# EAGLE design D1 - No LCD (EAGLE 9.5.2)
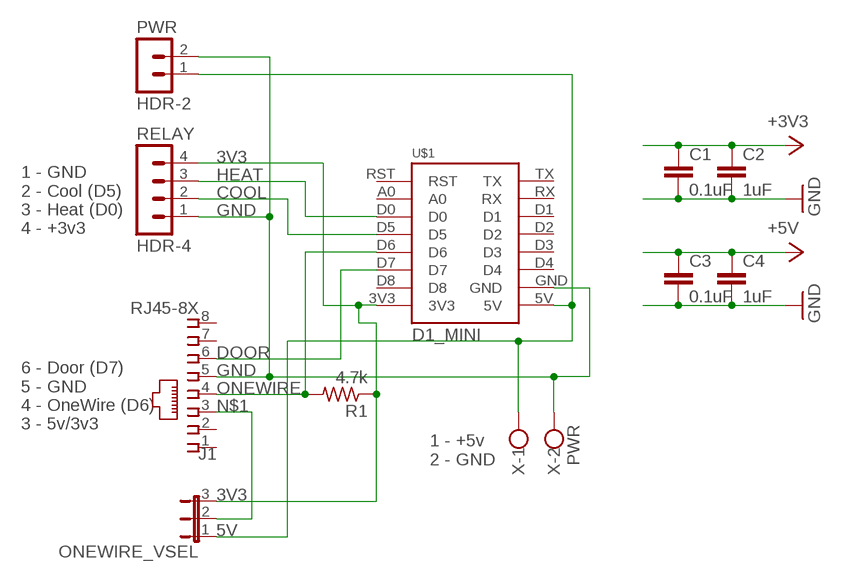
[diagram p0: schematic, sheet 1]

## Parts
C1  0.1uF  C-EU050-030X075  [C050-030X075]
C2  1uF  C-EU050-030X075  [C050-030X075]
C3  0.1uF  C-EU050-030X075  [C050-030X075]
C4  1uF  C-EU050-030X075  [C050-030X075]
J1  RJ45-8X  [RJ45-NS-XDIM]
ONEWIRE_VSEL  JP2ENOLABEL  [JP2-NOLABEL]
PWR  HDR-2  [HDR-2_VERT]
R1  4.7k  R-US_0309/12  [0309/12]
RELAY  HDR-4  [HDR-4_VERT]
U$1  D1_MINI  WEMOSCLEAN  [WEMOS-CLEAN]
X  PWR  W237-102  [W237-102]

## Nets
3V3 [3v]: C1.1 C2.1 ONEWIRE_VSEL.3 R1.1 RELAY.4 U$1.3V3 ; supply symbol labelled +3V3
5V [5v]: C3.1 C4.1 ONEWIRE_VSEL.1 PWR.1 U$1.5V X.1 ; supply symbol labelled +5V
COOL: RELAY.2 U$1.D5
DOOR: J1.6 U$1.D7
GND [Gnd]: C1.2 C2.2 C3.2 C4.2 J1.5 PWR.2 RELAY.1 U$1.GND X.2
HEAT: RELAY.3 U$1.D0
N$1: J1.3 ONEWIRE_VSEL.2
ONEWIRE: J1.4 R1.2 U$1.D6
Unconnected: J1.1 J1.2 J1.7 J1.8 U$1.A0 U$1.D1 U$1.D2 U$1.D3 U$1.D4 U$1.D8 U$1.RST U$1.RX U$1.TX

## Notes on the sheet
- 1 - GND
  2 - Cool (D5)
  3 - Heat (D0)
  4 - +3v3
- 6 - Door (D7)
  5 - GND
  4 - OneWire (D6) 
  3 - 5v/3v3
- 1 - +5v
  2 - GND

## Library data of the parts
C1-C4 = rcl:C-EU: CAPACITOR, European symbol; SPICEPREFIX: C
J1 = Donnie:RJ45: CORCOM Modular RJ Jacks No Shield Source: www.tycoelectronics.com .. ENG_DS_1654001_1099_RJ_L_0507.pdf; MPN: RJ45-8X; OC_FARNELL: unknown; OC_NEWARK: 16R6101
ONEWIRE_VSEL = Donnie:JP2E: JUMPER
PWR = Donnie:HDR-2
R1 = rcl:R-US_: RESISTOR, American symbol; SPICEPREFIX: R
RELAY = Donnie:HDR-4: PIN HEADER
U$1 = 1455413453956-wemos:WEMOS: LoLin D1 Mini controller socket
X = con-wago-500:W237-102: WAGO SCREW CLAMP; MPN: 237-102; OC_FARNELL: unknown; OC_NEWARK: 70K9898

## Net classes
0 default: width 0.305 mm, clearance 0.305 mm
1 5v: width 0.406 mm, clearance 0.406 mm
2 3v: width 0.406 mm, clearance 0.406 mm
3 Gnd: width 0.406 mm, clearance 0.406 mm

## Board
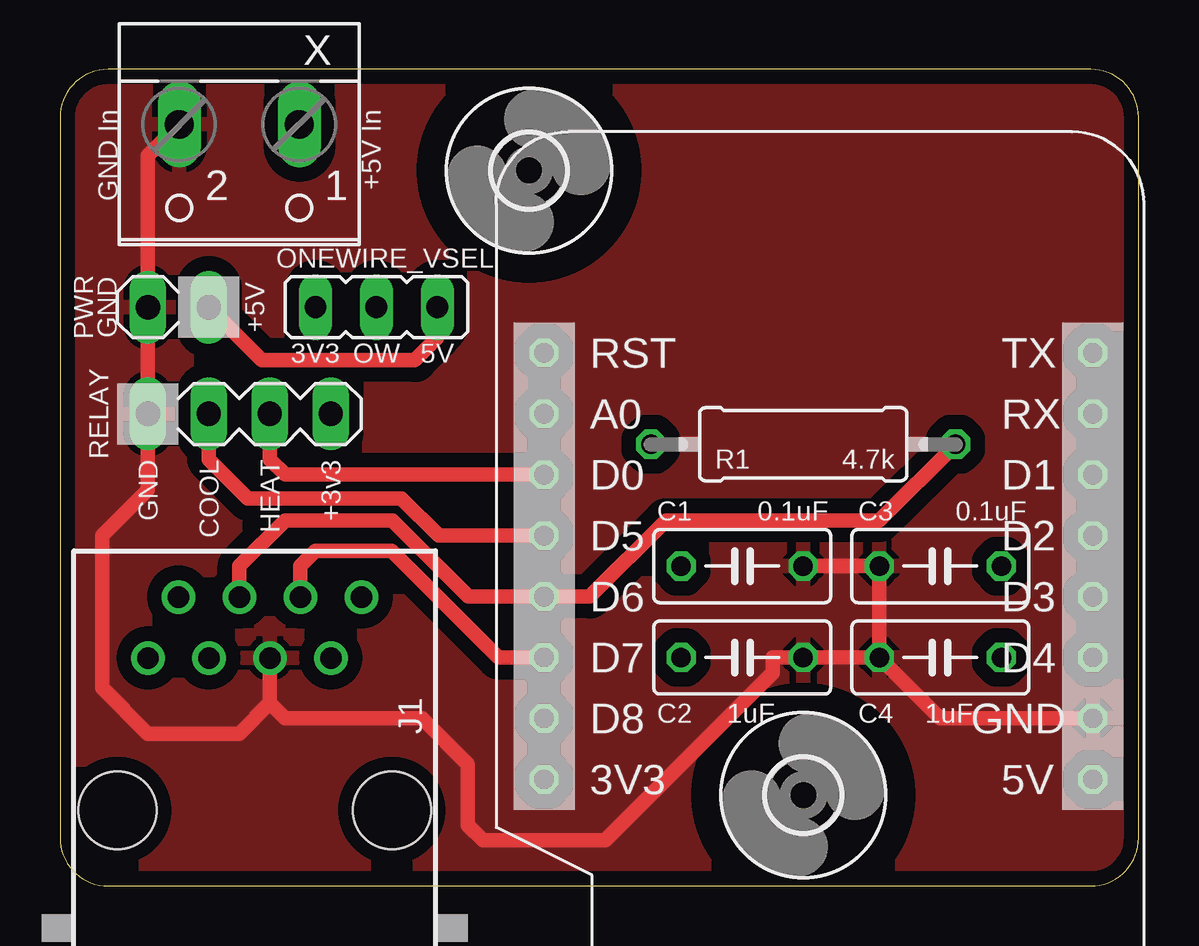
[diagram p1: board, top side]
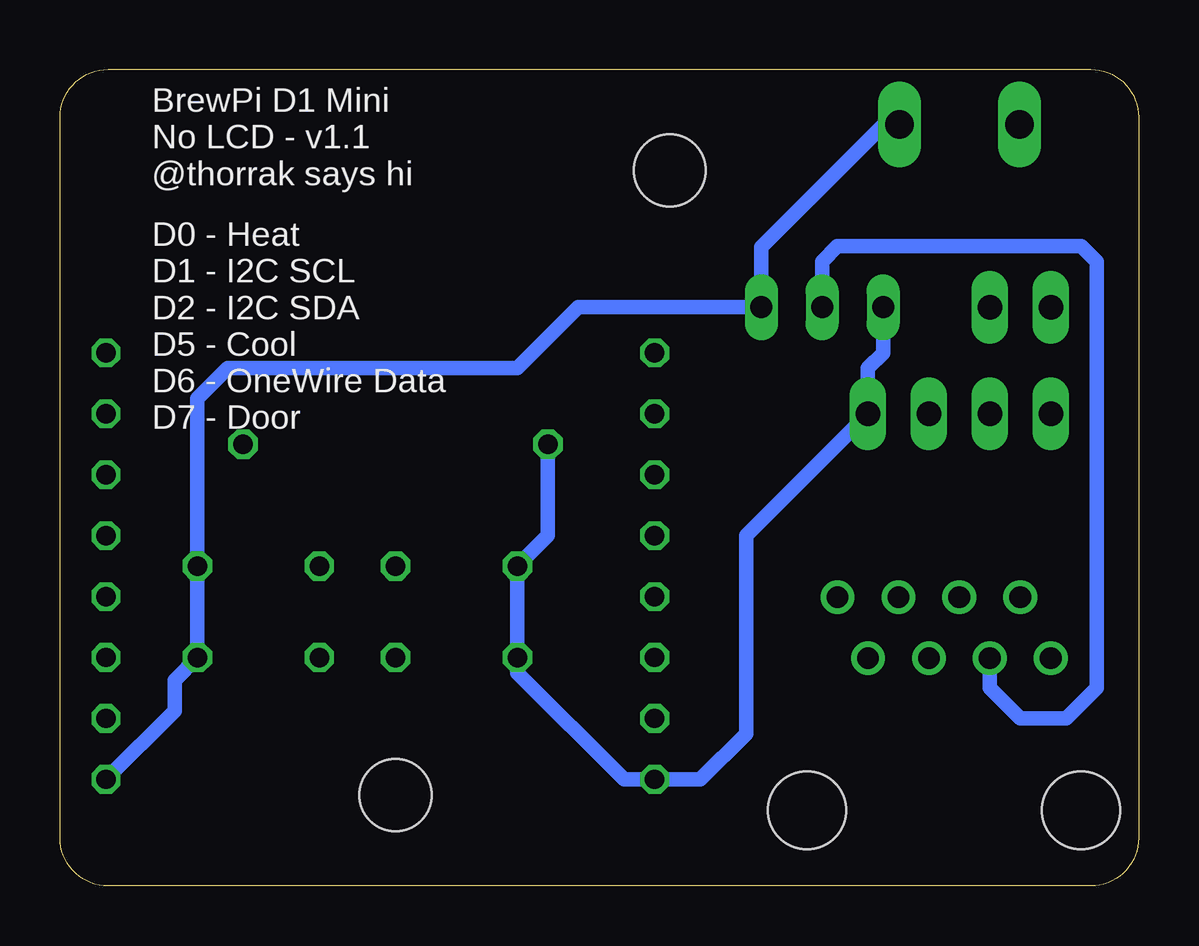
[diagram p2: board, bottom side, seen from below]

Size 44.95 x 34.05 mm. Coordinates in mm from the lower left corner, seen from the top.
Outline: 2,0 42.95,0 arc90 44.95,2 44.95,32.05 arc90 42.95,34.05 2,34.05 arc90 0,32.05 0,2 arc90 2,0
Copper layers (1*16): Top 0.0356mm / dielectric 1.5011mm / Bottom 0.0356mm
Design rules "PCBs_io": minimum track width 6mil, minimum drill 13mil, track to track 6mil, track to pad 6mil, pad to pad 6mil, via to via 6mil, smd to smd 6mil, copper to edge 15mil, drill to drill 6mil, minimum pad ring 7mil, minimum via ring 7mil, stop-mask expansion 3mil, vias tented up to drill 0mil, thermal gap 10mil

### Footprints (pad centres in the part's own frame; a part is rotated, then mirrored left to right if it is on the bottom)
C050-030X075 = drill 0.813 octagon: 1 -2.54,0; 2 2.54,0
RJ45-NS-XDIM = drill 0.9 pad 1.4: 1 -4.445,6.35; 2 -3.175,8.89; 3 -1.905,6.35; 4 -0.635,8.89; 5 0.635,6.35; 6 1.905,8.89; 7 3.175,6.35; 8 4.445,8.89 | hole 3.251: -5.715,0; 5.715,0
JP2-NOLABEL = drill 0.914 long: 1 -2.54,0; 2 0,0; 3 2.54,0
HDR-2_VERT = drill 1.016 long: 1 0,0; 2 2.54,0
0309/12 = drill 0.813 octagon: 1 -6.35,0; 2 6.35,0
HDR-4_VERT = drill 1.016 long: 1 0,0; 2 2.54,0; 3 5.08,0; 4 7.62,0
WEMOS-CLEAN = drill 0.8 octagon: 3V3 0,0; 5V 22.86,0; A0 0,15.24; D0 0,12.7; D1 22.86,12.7; D2 22.86,10.16; D3 22.86,7.62; D4 22.86,5.08; D5 0,10.16; D6 0,7.62; D7 0,5.08; D8 0,2.54; GND 22.86,2.54; RST 0,17.78; RX 22.86,15.24; TX 22.86,17.78
3,0 = hole 3: 0,0
W237-102 = drill 1.194 long: 1 -2.5,-1.27; 2 2.5,-1.27

### Placement (x,y rotation side)
C1  28.43,13.34 0 top
C2  28.43,9.53 0 top
C3  36.68,13.34 180 top
C4  36.68,9.53 180 top
J1  8.11,3.15 0 top
ONEWIRE_VSEL  13.19,24.13 180 top
PWR  6.2,24.13 180 top
R1  30.96,18.41 0 top
RELAY  3.66,19.68 0 top
U$1  20.17,4.45 0 top
U$4  [3,0]  30.97,3.79 0 top
U$5  [3,0]  19.54,29.82 0 top
X  7.47,30.48 180 top

### Tracks (layer width: path | path; a pad name or v marks a point on that pad's centre or on a via)
3V3
  Bottom 0.61: R1.1 24.62,14.61 C1.1 C2.1 25.89,8.89 21.44,4.45 U$1.3V3 18.27,4.45 16.36,6.35 16.36,14.61 RELAY.4 11.28,21.59 10.64,22.23 ONEWIRE_VSEL.3
5V
  Top 0.61: ONEWIRE_VSEL.1 15.72,22.86 14.79,21.92 8.41,21.92 PWR.1
  Bottom 0.61: U$1.5V 40.17,7.3 40.17,8.57 C4.1 C3.1 39.22,20.32 37.95,21.59 25.89,21.59 23.35,24.13 ONEWIRE_VSEL.1 15.72,26.63 10.61,31.75 X.1 10.01,31.71
COOL
  Top 0.61: RELAY.2 6.2,17.78 7.83,16.15 14.22,16.15 15.77,14.61 U$1.D5
DOOR
  Top 0.61: U$1.D7 18.27,9.53 13.82,13.97 10.64,13.97 10.01,13.34 J1.6
GND
  Top 0.61: C1.2 C3.2 C4.2 | C4.2 C2.2 29.7,9.53 29.7,8.89 22.71,1.91 17.63,1.91 17,2.54 17,5.08 15.09,6.99 9.38,6.99 8.74,7.62 | C4.2 36.68,6.99 U$1.GND | X.2 3.66,30.44 PWR.2 RELAY.1 3.66,16.51 1.76,14.61 1.76,8.26 3.66,6.35 7.47,6.35 8.74,7.62 | J1.5 8.74,7.62
  pour Top (isolate 0.61): 0.1,34.29 44.94,34.29 44.94,0 0.1,0
HEAT
  Top 0.61: RELAY.3 8.74,17.78 9.38,17.14 U$1.D0
N$1
  Bottom 0.61: ONEWIRE_VSEL.2 13.19,26.04 12.55,26.67 2.39,26.67 1.76,26.04 1.76,8.26 3.02,6.99 4.93,6.99 6.21,8.26 J1.3
ONEWIRE
  Top 0.61: J1.4 7.47,13.34 9.38,15.24 13.84,15.24 17.02,12.06 U$1.D6 22.08,12.06 25.25,15.24 34.14,15.24 R1.2

### Text on the board
tPlace: GND In | +5V In | GND | +5V | 3V3 | OW | 5V | GND | COOL | HEAT | +3v3
tNames: 4.7k | 0.1uF | 0.1uF | 1uF | 1uF
bNames: BrewPi D1 Mini / No LCD - v1.1 / @thorrak says hi | D0 - Heat / D1 - I2C SCL / D2 - I2C SDA / D5 - Cool / D6 - OneWire Data / D7 - Door